# Altium schematic sheet Power.SchDoc
size 297 x 210 mm
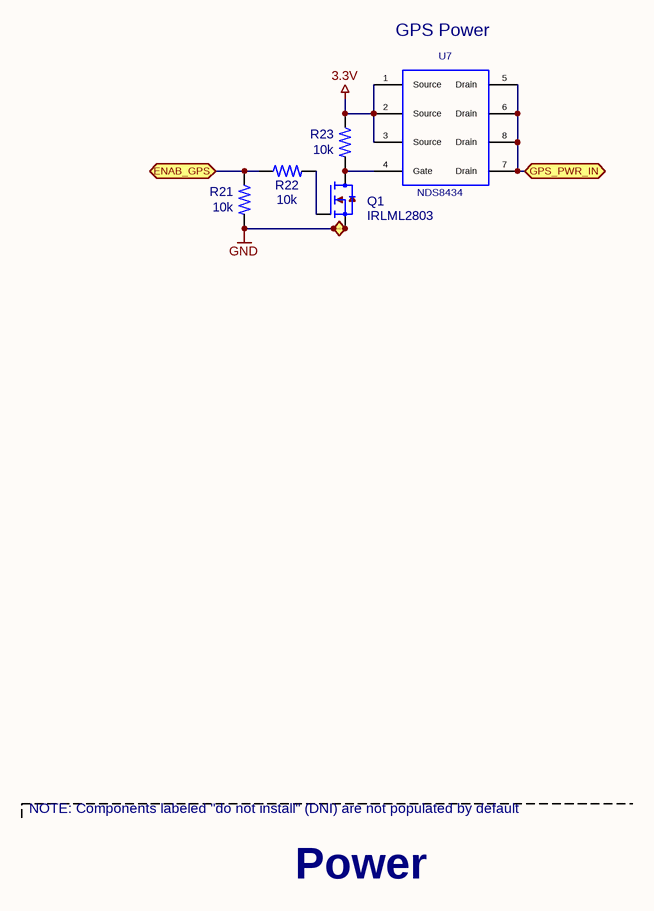
[diagram p0: Power.SchDoc]

## Parts
Q1  IRLML2803  [SOT-23]
R21  10k  [R_0603_1608Metric]
R22  10k  [R_0603_1608Metric]
R23  10k  [R_0603_1608Metric]
U7  NDS8434  [NDS8434]

## Ports
ENAB_GPS (bidir), GND (bidir), GPS_PWR_IN (bidir)

## Nets
3.3V: R23.1 U7.1(Source) U7.2(Source) U7.3(Source)
GND: Q1.2(S) R21.2 ; port GND
ENAB_GPS: R21.1 R22.1 ; port ENAB_GPS
GPS_PWR_IN: U7.5(Drain) U7.6(Drain) U7.7(Drain) U7.8(Drain) ; port GPS_PWR_IN
NetQ1_1: Q1.1(G) R22.2
NetQ1_3: Q1.3(D) R23.2 U7.4(Gate)

## Notes on the sheet
- (near U7) GPS Power
- NOTE: Components labeled "do not install" (DNI) are not populated by default
- Power
- 1
- 2
- 3
- 4
- 5
- 6
- A
- B
- C
- D
- Title: PyCubed Mainboard
- File: Power.sch
- Sheet: /
- Max Holliday
- KiCad E.D.A.  kicad (5.1.4)-1
- Size: A4
- Date: 2020-02-10
- Rev: v04
- Id: 4/6

## Library data of the parts
Q1 = IRLML2803TRPBF: Proto: 2302; Value: IRLML2803; Footprint: mainboard:SOT-23; MPN: IRLML2803
R21-R23 = R-US_R0603: MPN: RNCP0603FTD10K0; Value: 10k; Footprint: Resistor_SMD:R_0603_1608Metric
U7 = NDS8434: MPN: IRF7404TRPBF; Proto: DMP2022LSS-13; Value: NDS8434; Footprint: custom-footprints:NDS8434